# Altium schematic sheet REGENIX_I2C.SchDoc
size Tabloid; SheetNumber: 5; SheetTotal: 17; Sheet_Name: Insert name in Document Parameters; Size: 11x17
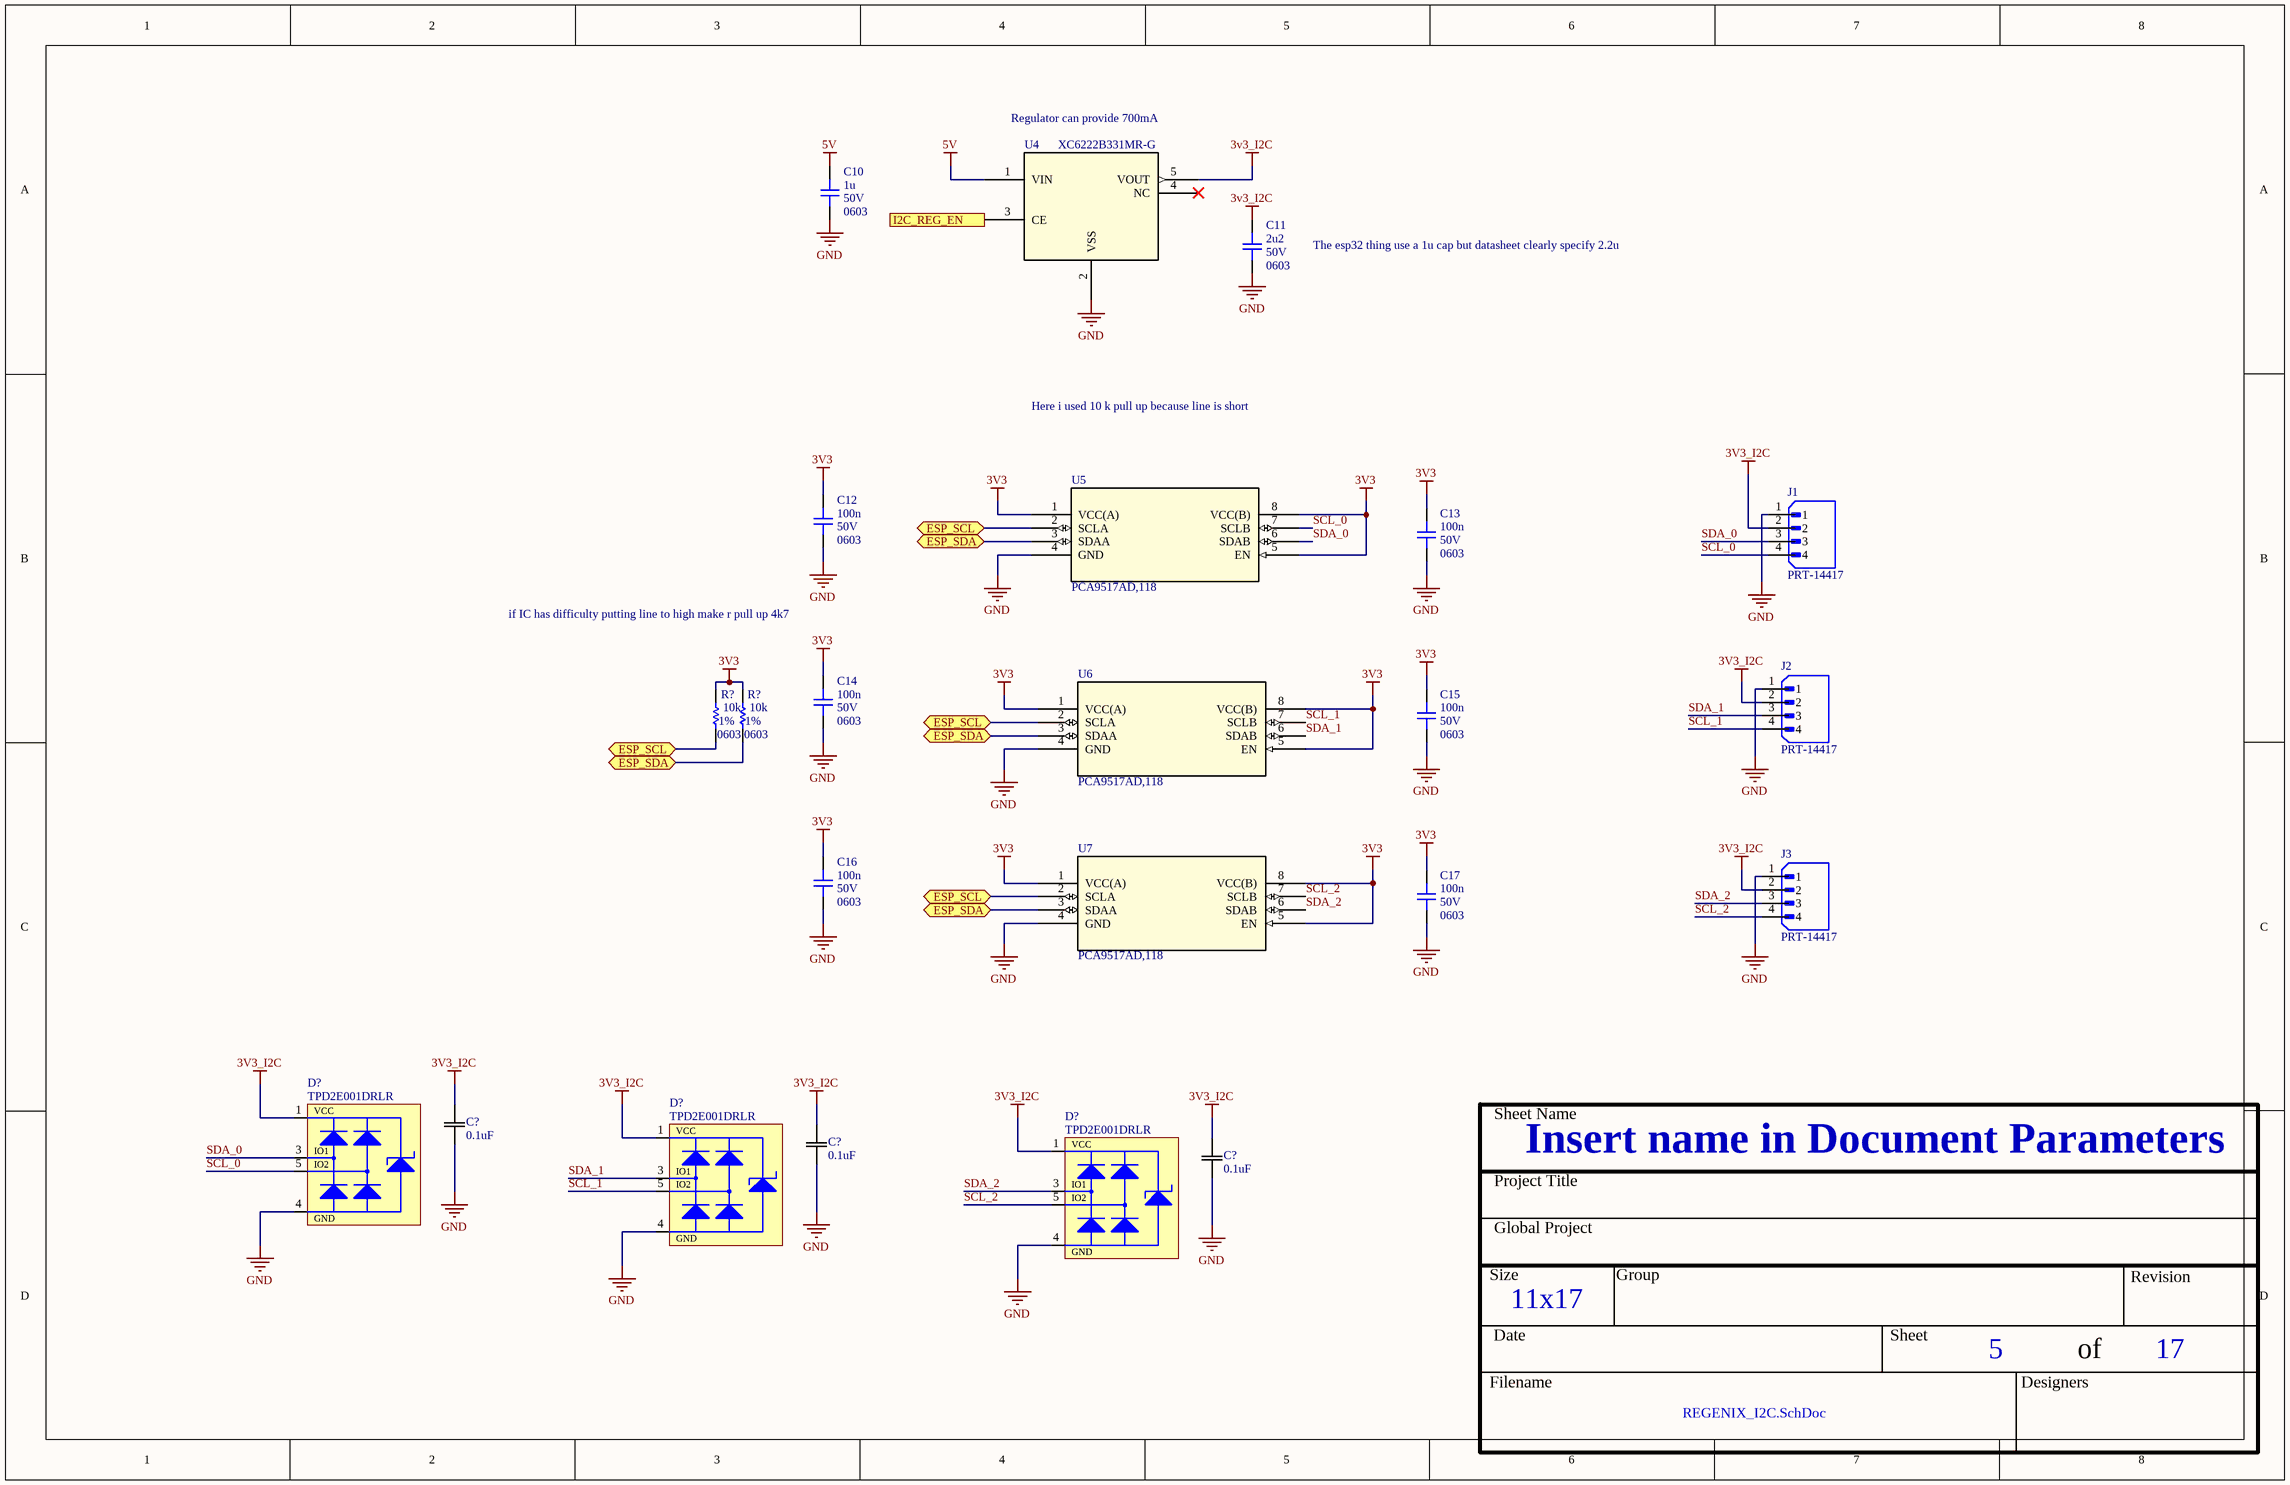
[diagram p0: REGENIX_I2C.SchDoc]

## Parts
(Parts that share a designator on the sheet are numbered #1, #2 ... from top to bottom, then left to right.)
C10  value 1u  Voltage: 50V  Package: 0603  [CAP_0603]  (hidden comment: CAP - 0603)
C11  value 2u2  Voltage: 50V  Package: 0603  [CAP_0603]  (hidden comment: CAP - 0603)
C12  value 100n  Voltage: 50V  Package: 0603  [CAP_0603]  (hidden comment: CAP - 0603)
C13  value 100n  Voltage: 50V  Package: 0603  [CAP_0603]  (hidden comment: CAP - 0603)
C14  value 100n  Voltage: 50V  Package: 0603  [CAP_0603]  (hidden comment: CAP - 0603)
C15  value 100n  Voltage: 50V  Package: 0603  [CAP_0603]  (hidden comment: CAP - 0603)
C16  value 100n  Voltage: 50V  Package: 0603  [CAP_0603]  (hidden comment: CAP - 0603)
C17  value 100n  Voltage: 50V  Package: 0603  [CAP_0603]  (hidden comment: CAP - 0603)
C?#1  0.1uF  [CAP_CL10_SAM]
C?#2  0.1uF  [CAP_CL10_SAM]
C?#3  0.1uF  [CAP_CL10_SAM]
D?#1  TPD2E001DRLR  [TVS_USB_TPD2E001DRLR]
D?#2  TPD2E001DRLR  [TVS_USB_TPD2E001DRLR]
D?#3  TPD2E001DRLR  [TVS_USB_TPD2E001DRLR]
J1  PRT-14417  [SPARKFUN_PRT-14417]
J2  PRT-14417  [SPARKFUN_PRT-14417]
J3  PRT-14417  [SPARKFUN_PRT-14417]
R?#1  value 10k  Package: 0603  Precision: 1%  [RES_0603]  (hidden comment: RES - 0603)
R?#2  value 10k  Package: 0603  Precision: 1%  [RES_0603]  (hidden comment: RES - 0603)
U4  XC6222B331MR-G  [SOT-25_TOR]
U5  PCA9517AD,118  [SO8_SOT96-1_NXP]
U6  PCA9517AD,118  [SO8_SOT96-1_NXP]
U7  PCA9517AD,118  [SO8_SOT96-1_NXP]

## Ports
ESP_SCL (bidir), ESP_SDA (bidir), I2C_REG_EN

## Nets
3V3: C12.2 C13.2 C14.2 C15.2 C16.2 C17.2 R?#1.2 R?#2.2 U5.1(VCC(A)) U5.5(EN) U5.8(VCC(B)) U6.1(VCC(A)) U6.5(EN) U6.8(VCC(B)) U7.1(VCC(A)) U7.5(EN) U7.8(VCC(B))
3V3_I2C: C11.2 C?#1.2 C?#2.2 C?#3.2 D?#1.1(VCC) D?#2.1(VCC) D?#3.1(VCC) J1.2 J2.2 J3.2 U4.5(VOUT)
5V: C10.2 U4.1(VIN)
GND: C10.1 C11.1 C12.1 C13.1 C14.1 C15.1 C16.1 C17.1 C?#1.1 C?#2.1 C?#3.1 D?#1.4(GND) D?#2.4(GND) D?#3.4(GND) J1.1 J2.1 J3.1 U4.2(VSS) U5.4(GND) U6.4(GND) U7.4(GND)
ESP_SCL: R?#1.1 U5.2(SCLA) U6.2(SCLA) U7.2(SCLA) ; port ESP_SCL
ESP_SDA: R?#2.1 U5.3(SDAA) U6.3(SDAA) U7.3(SDAA) ; port ESP_SDA
I2C_REG_EN: U4.3(CE) ; port I2C_REG_EN
SCL_0: D?#1.5(IO2) J1.4 U5.7(SCLB)
SCL_1: D?#2.5(IO2) J2.4 U6.7(SCLB)
SCL_2: D?#3.5(IO2) J3.4 U7.7(SCLB)
SDA_0: D?#1.3(IO1) J1.3 U5.6(SDAB)
SDA_1: D?#2.3(IO1) J2.3 U6.6(SDAB)
SDA_2: D?#3.3(IO1) J3.3 U7.6(SDAB)

Not connected (* = marked no-connect by the designer): D?#1 2(NC); D?#2 2(NC); D?#3 2(NC); U4 4(NC)*

## Notes on the sheet
- Regulator can provide 700mA
- The esp32 thing use a 1u cap but datasheet clearly specify 2.2u
- Here i used 10 k pull up because line is short
- if IC has difficulty putting line to high make r pull up 4k7
- Sheet Name
- Project Title
- Global Project
- Size
- Group
- Revision
- Date
- Sheet
- of
- Filename
- Designers

## Library data of the parts
C10-C17 = CAP - 0603: Precision: 10%; Current: *; CreatedBy: Jonathan Bouchard; Power: *
C?#1-C?#3 = CL10B104KB8NNWC: CAP CER 0.1UF 50V X7R 0603 CL10B104KB8NNWC; Mfr_Name: Samsung
D?#1-D?#3 = TVS_USB_TPD2E001DRLR: TVS - USB TVS DIODE 5.5V - SOT-553; Manufacturer #1: Texas Instruments; Value: 11V Breakdown; Voltage Rating: 5.5V (Max); GRAMS Lib Spec: 2.8; Magnetic Material: YES; Cryo: UNKNOWN; Tolerance: *; Current Rating: *; Power Max: *; HelpURL: http://www.ti.com/lit/ds/symlink/tpd2e001.pdf; CreatedBy/Date: Jonathan Bouchard 2018-07-10; VerifiedBy: Arnaud Samson 16-07-18; Temperature: -40°C ~ 85°C (TA); Package: SOT-553; Manufacturer #2: *; Note: *; Assembly Type: SMD; Part Number #2: *; Part Number #1: TPD2E001DRLR; Polarized: YES; Supplier 1: Digi-Key; Supplier Part Number 1: 296-21883-1-ND
J1-J3 = PRT-14417: QWIIC JST CONNECTOR - SMD 4-PIN; MF: SparkFun Electronics; SnapEDA_Link: https://www.snapeda.com/parts/PRT-14417/SparkFun+Electronics/view-part/?ref=snap; Package: None; Value: *; MP: PRT-14417; Check_prices: https://www.snapeda.com/parts/PRT-14417/SparkFun+Electronics/view-part/?ref=eda
U4 = XC6222B331MR-G: No Description Available; Mfr_Name: Torex Semiconductor; RefDes: RefDes; Type: Type
U5-U7 = PCA9517AD,118: No Description Available; Mfr_Name: NXP; RefDes: RefDes; Type: Type
R?#1 R?#2 = RES - 0603: Current: *; CreatedBy: Jonathan Bouchard